# EAGLE board LEDPanel (EAGLE 9.6.2), part 1 of 2
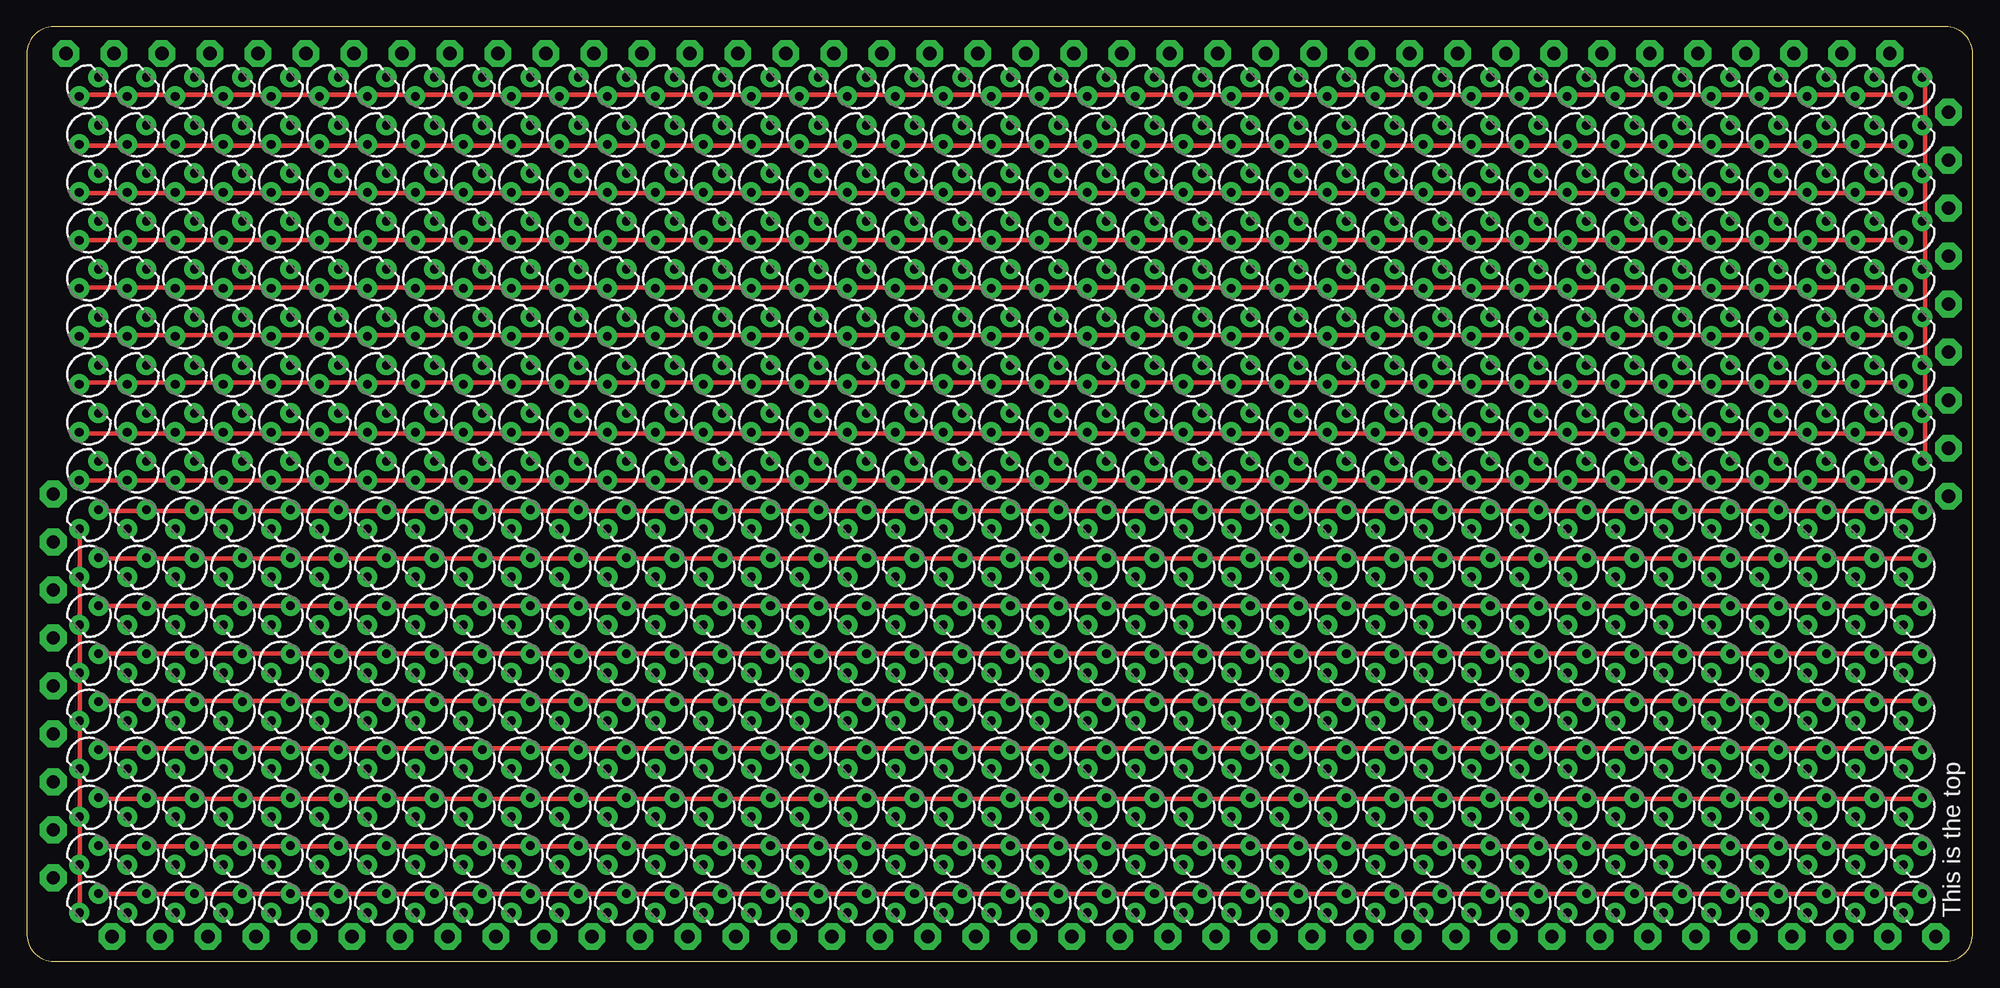
[diagram p1: board, top side]
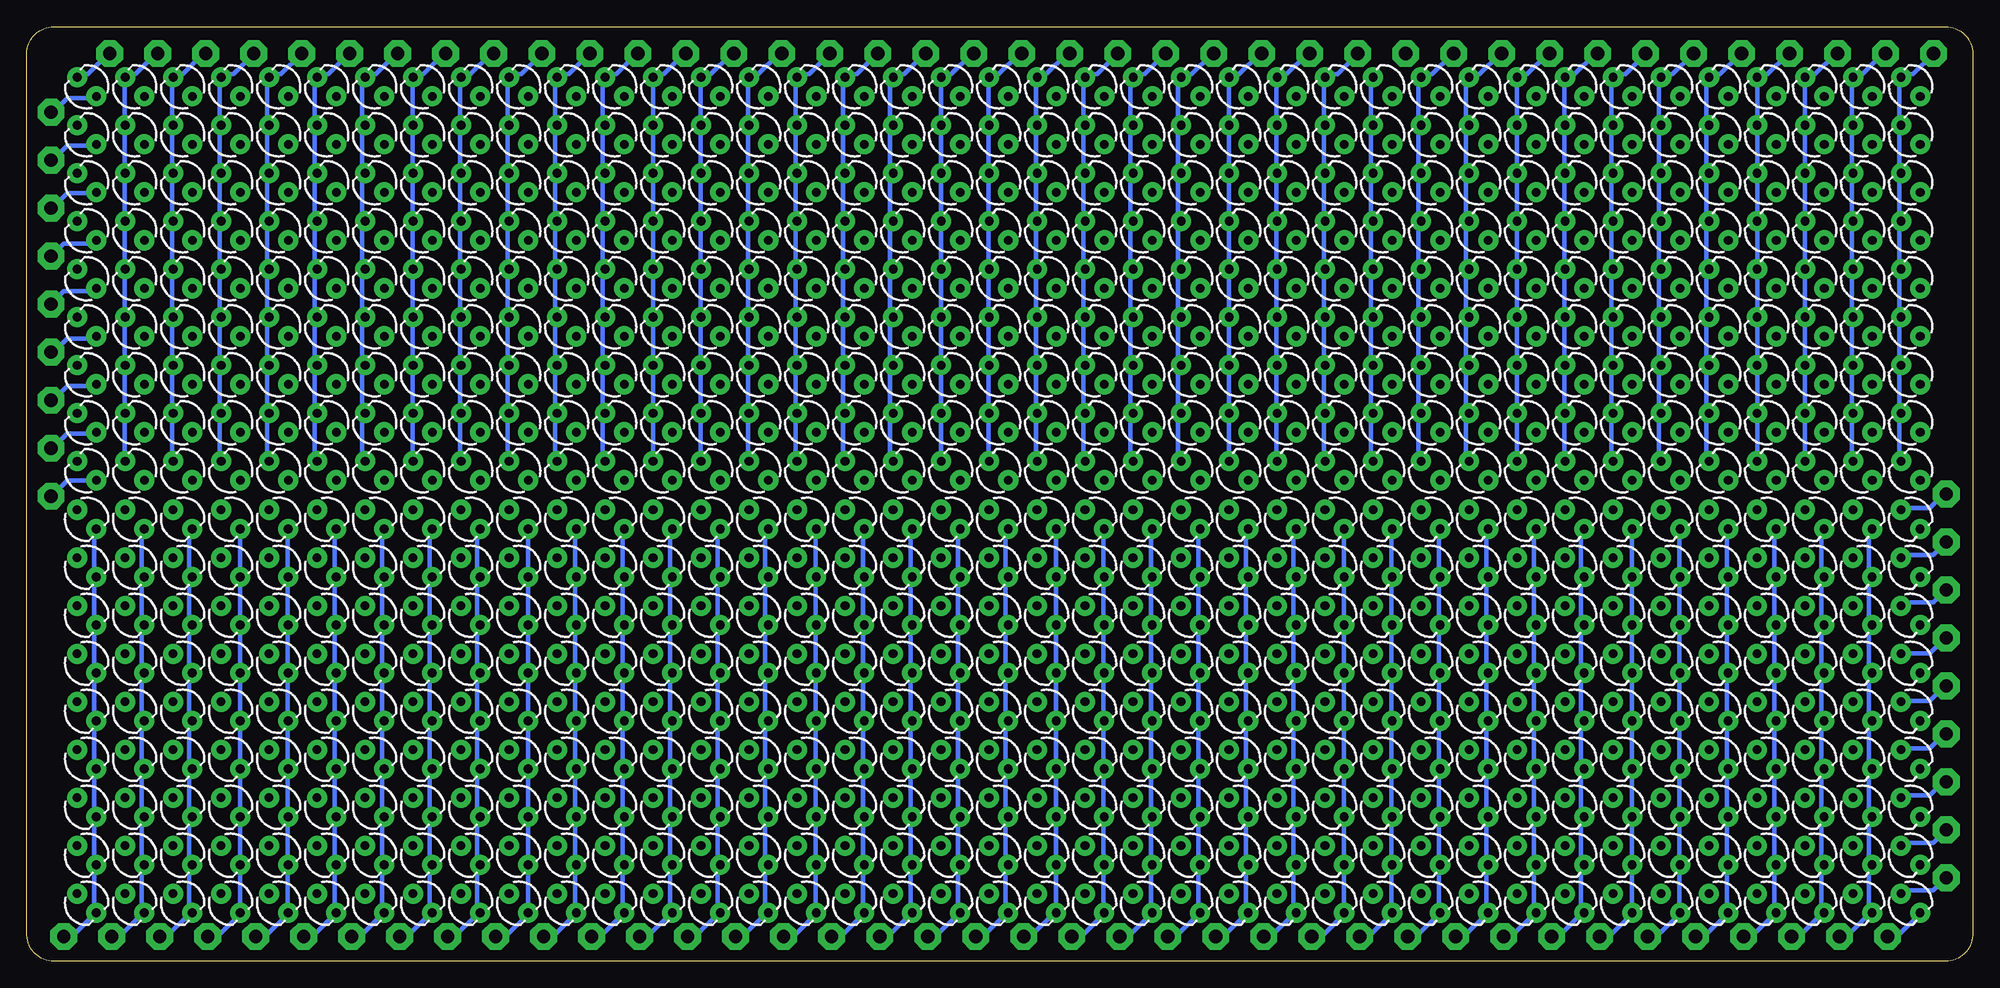
[diagram p2: board, bottom side, seen from below]

Size 182.46 x 87.65 mm. Coordinates in mm from the lower left corner, seen from the top.
Outline: 0,85.11 0,2.67 arc90 2.54,0 179.92,0 arc90 182.46,2.67 182.46,85.11 arc90 179.92,87.65 2.54,87.65 arc90 0,85.11
Copper layers (1*16): Top 0.035mm / dielectric 1.5mm / Bottom 0.035mm
Design rules "default *": minimum track width 16mil, minimum drill 0.3mm, track to track 6mil, track to pad 6mil, pad to pad 6mil, via to via 6mil, smd to smd 6mil, copper to edge 40mil, drill to drill 6mil, minimum pad ring 10mil, minimum via ring 8mil, stop-mask expansion 4mil, vias tented up to drill 20mil, thermal gap 10mil

## Footprints (pad centres in the part's own frame; a part is rotated, then mirrored left to right if it is on the bottom)
LED_3MM = drill 0.813 pad 1.88: A -1.27,0; K 1.27,0
COLUMNS = drill 1.25 pad 2.5 octagon: P$1 0,0; P$2 4.5,0; P$3 9,0; P$4 13.5,0; P$5 18,0; P$6 22.5,0; P$7 27,0; P$8 31.5,0; P$9 36,0; P$10 40.5,0; P$11 45,0; P$12 49.5,0; P$13 54,0; P$14 58.5,0; P$15 63,0; P$16 67.5,0; P$17 72,0; P$18 76.5,0; P$19 81,0; P$20 85.5,0; P$21 90,0; P$22 94.5,0; P$23 99,0; P$24 103.5,0; P$25 108,0; P$26 112.5,0; P$27 117,0; P$28 121.5,0; P$29 126,0; P$30 130.5,0; P$31 135,0; P$32 139.5,0; P$33 144,0; P$34 148.5,0; P$35 153,0; P$36 157.5,0; P$37 162,0; P$38 166.5,0; P$39 171,0
ROWS = drill 1.25 pad 2.5 octagon: P$1 0,0; P$2 0,-4.5; P$3 0,-9; P$4 0,-13.5; P$5 0,-18; P$6 0,-22.5; P$7 0,-27; P$8 0,-31.5; P$9 0,-36

## Placement (x,y rotation side)
LED1  [LED_3MM]  5.83,46.01 45 top
LED2  [LED_3MM]  10.33,46.01 45 top
LED3  [LED_3MM]  14.83,46.01 45 top
LED4  [LED_3MM]  19.33,46.01 45 top
LED5  [LED_3MM]  23.83,46.01 45 top
LED6  [LED_3MM]  28.33,46.01 45 top
LED7  [LED_3MM]  32.83,46.01 45 top
LED8  [LED_3MM]  37.33,46.01 45 top
LED9  [LED_3MM]  41.83,46.01 45 top
LED10  [LED_3MM]  46.33,46.01 45 top
LED11  [LED_3MM]  50.83,46.01 45 top
LED12  [LED_3MM]  55.33,46.01 45 top
LED13  [LED_3MM]  59.83,46.01 45 top
LED14  [LED_3MM]  64.33,46.01 45 top
LED15  [LED_3MM]  68.83,46.01 45 top
LED16  [LED_3MM]  73.33,46.01 45 top
LED17  [LED_3MM]  77.83,46.01 45 top
LED18  [LED_3MM]  82.33,46.01 45 top
LED19  [LED_3MM]  86.83,46.01 45 top
LED20  [LED_3MM]  91.33,46.01 45 top
LED21  [LED_3MM]  95.83,46.01 45 top
LED22  [LED_3MM]  100.33,46.01 45 top
LED23  [LED_3MM]  104.83,46.01 45 top
LED24  [LED_3MM]  109.33,46.01 45 top
LED25  [LED_3MM]  113.83,46.01 45 top
LED26  [LED_3MM]  118.33,46.01 45 top
LED27  [LED_3MM]  122.83,46.01 45 top
LED28  [LED_3MM]  127.33,46.01 45 top
LED29  [LED_3MM]  131.83,46.01 45 top
LED30  [LED_3MM]  136.33,46.01 45 top
LED31  [LED_3MM]  140.83,46.01 45 top
LED32  [LED_3MM]  145.33,46.01 45 top
LED33  [LED_3MM]  149.83,46.01 45 top
LED34  [LED_3MM]  154.33,46.01 45 top
LED35  [LED_3MM]  158.83,46.01 45 top
LED36  [LED_3MM]  163.33,46.01 45 top
LED37  [LED_3MM]  167.83,46.01 45 top
LED38  [LED_3MM]  172.33,46.01 45 top
LED39  [LED_3MM]  176.83,46.01 45 top
LED313  [LED_3MM]  5.83,50.51 45 top
LED314  [LED_3MM]  5.83,55.01 45 top
LED315  [LED_3MM]  5.83,59.51 45 top
LED316  [LED_3MM]  5.83,64.01 45 top
LED317  [LED_3MM]  5.83,68.51 45 top
LED318  [LED_3MM]  5.83,73.01 45 top
LED319  [LED_3MM]  5.83,77.51 45 top
LED320  [LED_3MM]  5.83,82.01 45 top
LED321  [LED_3MM]  10.33,50.51 45 top
LED322  [LED_3MM]  10.33,55.01 45 top
LED323  [LED_3MM]  10.33,59.51 45 top
LED324  [LED_3MM]  10.33,64.01 45 top
LED325  [LED_3MM]  10.33,68.51 45 top
LED326  [LED_3MM]  10.33,73.01 45 top
LED327  [LED_3MM]  10.33,77.51 45 top
LED328  [LED_3MM]  10.33,82.01 45 top
LED329  [LED_3MM]  14.83,50.51 45 top
LED330  [LED_3MM]  14.83,55.01 45 top
LED331  [LED_3MM]  14.83,59.51 45 top
LED332  [LED_3MM]  14.83,64.01 45 top
LED333  [LED_3MM]  14.83,68.51 45 top
LED334  [LED_3MM]  14.83,73.01 45 top
LED335  [LED_3MM]  14.83,77.51 45 top
LED336  [LED_3MM]  14.83,82.01 45 top
LED337  [LED_3MM]  19.33,50.51 45 top
LED338  [LED_3MM]  19.33,55.01 45 top
LED339  [LED_3MM]  19.33,59.51 45 top
LED340  [LED_3MM]  19.33,64.01 45 top
LED341  [LED_3MM]  19.33,68.51 45 top
LED342  [LED_3MM]  19.33,73.01 45 top
LED343  [LED_3MM]  19.33,77.51 45 top
LED344  [LED_3MM]  19.33,82.01 45 top
LED345  [LED_3MM]  23.83,50.51 45 top
LED346  [LED_3MM]  23.83,55.01 45 top
LED347  [LED_3MM]  23.83,59.51 45 top
LED348  [LED_3MM]  23.83,64.01 45 top
LED349  [LED_3MM]  23.83,68.51 45 top
LED350  [LED_3MM]  23.83,73.01 45 top
LED351  [LED_3MM]  23.83,77.51 45 top
LED352  [LED_3MM]  23.83,82.01 45 top
LED353  [LED_3MM]  28.33,50.51 45 top
LED354  [LED_3MM]  28.33,55.01 45 top
LED355  [LED_3MM]  28.33,59.51 45 top
LED356  [LED_3MM]  28.33,64.01 45 top
LED357  [LED_3MM]  28.33,68.51 45 top
LED358  [LED_3MM]  28.33,73.01 45 top
LED359  [LED_3MM]  28.33,77.51 45 top
LED360  [LED_3MM]  28.33,82.01 45 top
LED361  [LED_3MM]  32.83,50.51 45 top
LED362  [LED_3MM]  32.83,55.01 45 top
LED363  [LED_3MM]  32.83,59.51 45 top
LED364  [LED_3MM]  32.83,64.01 45 top
LED365  [LED_3MM]  32.83,68.51 45 top
LED366  [LED_3MM]  32.83,73.01 45 top
LED367  [LED_3MM]  32.83,77.51 45 top
LED368  [LED_3MM]  32.83,82.01 45 top
LED369  [LED_3MM]  37.33,50.51 45 top
LED370  [LED_3MM]  37.33,55.01 45 top
LED371  [LED_3MM]  37.33,59.51 45 top
LED372  [LED_3MM]  37.33,64.01 45 top
LED373  [LED_3MM]  37.33,68.51 45 top
LED374  [LED_3MM]  37.33,73.01 45 top
LED375  [LED_3MM]  37.33,77.51 45 top
LED376  [LED_3MM]  37.33,82.01 45 top
LED377  [LED_3MM]  41.83,50.51 45 top
LED378  [LED_3MM]  41.83,55.01 45 top
LED379  [LED_3MM]  41.83,59.51 45 top
LED380  [LED_3MM]  41.83,64.01 45 top
LED381  [LED_3MM]  41.83,68.51 45 top
LED382  [LED_3MM]  41.83,73.01 45 top
LED383  [LED_3MM]  41.83,77.51 45 top
LED384  [LED_3MM]  41.83,82.01 45 top
LED385  [LED_3MM]  46.33,50.51 45 top
LED386  [LED_3MM]  46.33,55.01 45 top
LED387  [LED_3MM]  46.33,59.51 45 top
LED388  [LED_3MM]  46.33,64.01 45 top
LED389  [LED_3MM]  46.33,68.51 45 top
LED390  [LED_3MM]  46.33,73.01 45 top
LED391  [LED_3MM]  46.33,77.51 45 top
LED392  [LED_3MM]  46.33,82.01 45 top
LED393  [LED_3MM]  50.83,50.51 45 top
LED394  [LED_3MM]  50.83,55.01 45 top
LED395  [LED_3MM]  50.83,59.51 45 top
LED396  [LED_3MM]  50.83,64.01 45 top
LED397  [LED_3MM]  50.83,68.51 45 top
LED398  [LED_3MM]  50.83,73.01 45 top
LED399  [LED_3MM]  50.83,77.51 45 top
LED400  [LED_3MM]  50.83,82.01 45 top
LED401  [LED_3MM]  55.33,50.51 45 top
LED402  [LED_3MM]  55.33,55.01 45 top
LED403  [LED_3MM]  55.33,59.51 45 top
LED404  [LED_3MM]  55.33,64.01 45 top
LED405  [LED_3MM]  55.33,68.51 45 top
LED406  [LED_3MM]  55.33,73.01 45 top
LED407  [LED_3MM]  55.33,77.51 45 top
LED408  [LED_3MM]  55.33,82.01 45 top
LED409  [LED_3MM]  59.83,50.51 45 top
LED410  [LED_3MM]  59.83,55.01 45 top
LED411  [LED_3MM]  59.83,59.51 45 top
LED412  [LED_3MM]  59.83,64.01 45 top
LED413  [LED_3MM]  59.83,68.51 45 top
LED414  [LED_3MM]  59.83,73.01 45 top
LED415  [LED_3MM]  59.83,77.51 45 top
LED416  [LED_3MM]  59.83,82.01 45 top
LED417  [LED_3MM]  64.33,50.51 45 top
LED418  [LED_3MM]  64.33,55.01 45 top
LED419  [LED_3MM]  64.33,59.51 45 top
LED420  [LED_3MM]  64.33,64.01 45 top
LED421  [LED_3MM]  64.33,68.51 45 top
LED422  [LED_3MM]  64.33,73.01 45 top
LED423  [LED_3MM]  64.33,77.51 45 top
LED424  [LED_3MM]  64.33,82.01 45 top
LED425  [LED_3MM]  68.83,50.51 45 top
LED426  [LED_3MM]  68.83,55.01 45 top
LED427  [LED_3MM]  68.83,59.51 45 top
LED428  [LED_3MM]  68.83,64.01 45 top
LED429  [LED_3MM]  68.83,68.51 45 top
LED430  [LED_3MM]  68.83,73.01 45 top
LED431  [LED_3MM]  68.83,77.51 45 top
LED432  [LED_3MM]  68.83,82.01 45 top
LED433  [LED_3MM]  73.33,50.51 45 top
LED434  [LED_3MM]  73.33,55.01 45 top
LED435  [LED_3MM]  73.33,59.51 45 top
LED436  [LED_3MM]  73.33,64.01 45 top
LED437  [LED_3MM]  73.33,68.51 45 top
LED438  [LED_3MM]  73.33,73.01 45 top
LED439  [LED_3MM]  73.33,77.51 45 top
LED440  [LED_3MM]  73.33,82.01 45 top
LED441  [LED_3MM]  77.83,50.51 45 top
LED442  [LED_3MM]  77.83,55.01 45 top
LED443  [LED_3MM]  77.83,59.51 45 top
LED444  [LED_3MM]  77.83,64.01 45 top
LED445  [LED_3MM]  77.83,68.51 45 top
LED446  [LED_3MM]  77.83,73.01 45 top
LED447  [LED_3MM]  77.83,77.51 45 top
LED448  [LED_3MM]  77.83,82.01 45 top
LED449  [LED_3MM]  82.33,50.51 45 top
LED450  [LED_3MM]  82.33,55.01 45 top
LED451  [LED_3MM]  82.33,59.51 45 top
LED452  [LED_3MM]  82.33,64.01 45 top
LED453  [LED_3MM]  82.33,68.51 45 top
LED454  [LED_3MM]  82.33,73.01 45 top
LED455  [LED_3MM]  82.33,77.51 45 top
LED456  [LED_3MM]  82.33,82.01 45 top
LED457  [LED_3MM]  86.83,50.51 45 top
LED458  [LED_3MM]  86.83,55.01 45 top
LED459  [LED_3MM]  86.83,59.51 45 top
LED460  [LED_3MM]  86.83,64.01 45 top
LED461  [LED_3MM]  86.83,68.51 45 top
LED462  [LED_3MM]  86.83,73.01 45 top
LED463  [LED_3MM]  86.83,77.51 45 top
LED464  [LED_3MM]  86.83,82.01 45 top
LED465  [LED_3MM]  91.33,50.51 45 top
LED466  [LED_3MM]  91.33,55.01 45 top
LED467  [LED_3MM]  91.33,59.51 45 top
LED468  [LED_3MM]  91.33,64.01 45 top
LED469  [LED_3MM]  91.33,68.51 45 top
LED470  [LED_3MM]  91.33,73.01 45 top
LED471  [LED_3MM]  91.33,77.51 45 top
LED472  [LED_3MM]  91.33,82.01 45 top
LED473  [LED_3MM]  95.83,50.51 45 top
LED474  [LED_3MM]  95.83,55.01 45 top
LED475  [LED_3MM]  95.83,59.51 45 top
LED476  [LED_3MM]  95.83,64.01 45 top
LED477  [LED_3MM]  95.83,68.51 45 top
LED478  [LED_3MM]  95.83,73.01 45 top
LED479  [LED_3MM]  95.83,77.51 45 top
LED480  [LED_3MM]  95.83,82.01 45 top
LED481  [LED_3MM]  100.33,50.51 45 top
LED482  [LED_3MM]  100.33,55.01 45 top
LED483  [LED_3MM]  100.33,59.51 45 top
LED484  [LED_3MM]  100.33,64.01 45 top
LED485  [LED_3MM]  100.33,68.51 45 top
LED486  [LED_3MM]  100.33,73.01 45 top
LED487  [LED_3MM]  100.33,77.51 45 top
LED488  [LED_3MM]  100.33,82.01 45 top
LED489  [LED_3MM]  104.83,50.51 45 top
LED490  [LED_3MM]  104.83,55.01 45 top
LED491  [LED_3MM]  104.83,59.51 45 top
LED492  [LED_3MM]  104.83,64.01 45 top
LED493  [LED_3MM]  104.83,68.51 45 top
LED494  [LED_3MM]  104.83,73.01 45 top
LED495  [LED_3MM]  104.83,77.51 45 top
LED496  [LED_3MM]  104.83,82.01 45 top
LED497  [LED_3MM]  109.33,50.51 45 top
LED498  [LED_3MM]  109.33,55.01 45 top
LED499  [LED_3MM]  109.33,59.51 45 top
LED500  [LED_3MM]  109.33,64.01 45 top
LED501  [LED_3MM]  109.33,68.51 45 top
LED502  [LED_3MM]  109.33,73.01 45 top
LED503  [LED_3MM]  109.33,77.51 45 top
LED504  [LED_3MM]  109.33,82.01 45 top
LED505  [LED_3MM]  113.83,50.51 45 top
LED506  [LED_3MM]  113.83,55.01 45 top
LED507  [LED_3MM]  113.83,59.51 45 top
LED508  [LED_3MM]  113.83,64.01 45 top
LED509  [LED_3MM]  113.83,68.51 45 top
LED510  [LED_3MM]  113.83,73.01 45 top
LED511  [LED_3MM]  113.83,77.51 45 top
LED512  [LED_3MM]  113.83,82.01 45 top
LED513  [LED_3MM]  118.33,50.51 45 top
LED514  [LED_3MM]  118.33,55.01 45 top
LED515  [LED_3MM]  118.33,59.51 45 top
LED516  [LED_3MM]  118.33,64.01 45 top
LED517  [LED_3MM]  118.33,68.51 45 top
LED518  [LED_3MM]  118.33,73.01 45 top
LED519  [LED_3MM]  118.33,77.51 45 top
LED520  [LED_3MM]  118.33,82.01 45 top
LED521  [LED_3MM]  122.83,50.51 45 top
LED522  [LED_3MM]  122.83,55.01 45 top
LED523  [LED_3MM]  122.83,59.51 45 top
LED524  [LED_3MM]  122.83,64.01 45 top
LED525  [LED_3MM]  122.83,68.51 45 top
LED526  [LED_3MM]  122.83,73.01 45 top
LED527  [LED_3MM]  122.83,77.51 45 top
LED528  [LED_3MM]  122.83,82.01 45 top
LED529  [LED_3MM]  127.33,50.51 45 top
LED530  [LED_3MM]  127.33,55.01 45 top
LED531  [LED_3MM]  127.33,59.51 45 top
LED532  [LED_3MM]  127.33,64.01 45 top
LED533  [LED_3MM]  127.33,68.51 45 top
LED534  [LED_3MM]  127.33,73.01 45 top
LED535  [LED_3MM]  127.33,77.51 45 top
LED536  [LED_3MM]  127.33,82.01 45 top
LED537  [LED_3MM]  131.83,50.51 45 top
LED538  [LED_3MM]  131.83,55.01 45 top
LED539  [LED_3MM]  131.83,59.51 45 top
LED540  [LED_3MM]  131.83,64.01 45 top
LED541  [LED_3MM]  131.83,68.51 45 top
LED542  [LED_3MM]  131.83,73.01 45 top
LED543  [LED_3MM]  131.83,77.51 45 top
LED544  [LED_3MM]  131.83,82.01 45 top
LED545  [LED_3MM]  136.33,50.51 45 top
LED546  [LED_3MM]  136.33,55.01 45 top
LED547  [LED_3MM]  136.33,59.51 45 top
LED548  [LED_3MM]  136.33,64.01 45 top
LED549  [LED_3MM]  136.33,68.51 45 top
LED550  [LED_3MM]  136.33,73.01 45 top
LED551  [LED_3MM]  136.33,77.51 45 top
LED552  [LED_3MM]  136.33,82.01 45 top
LED553  [LED_3MM]  140.83,50.51 45 top
LED554  [LED_3MM]  140.83,55.01 45 top
LED555  [LED_3MM]  140.83,59.51 45 top
LED556  [LED_3MM]  140.83,64.01 45 top
LED557  [LED_3MM]  140.83,68.51 45 top
LED558  [LED_3MM]  140.83,73.01 45 top
LED559  [LED_3MM]  140.83,77.51 45 top
LED560  [LED_3MM]  140.83,82.01 45 top
LED561  [LED_3MM]  145.33,50.51 45 top
LED562  [LED_3MM]  145.33,55.01 45 top
LED563  [LED_3MM]  145.33,59.51 45 top
LED564  [LED_3MM]  145.33,64.01 45 top
LED565  [LED_3MM]  145.33,68.51 45 top
LED566  [LED_3MM]  145.33,73.01 45 top
LED567  [LED_3MM]  145.33,77.51 45 top
LED568  [LED_3MM]  145.33,82.01 45 top
LED569  [LED_3MM]  149.83,50.51 45 top
LED570  [LED_3MM]  149.83,55.01 45 top
LED571  [LED_3MM]  149.83,59.51 45 top
LED572  [LED_3MM]  149.83,64.01 45 top
LED573  [LED_3MM]  149.83,68.51 45 top
LED574  [LED_3MM]  149.83,73.01 45 top
LED575  [LED_3MM]  149.83,77.51 45 top
LED576  [LED_3MM]  149.83,82.01 45 top
LED577  [LED_3MM]  154.33,50.51 45 top
LED578  [LED_3MM]  154.33,55.01 45 top
LED579  [LED_3MM]  154.33,59.51 45 top
LED580  [LED_3MM]  154.33,64.01 45 top
LED581  [LED_3MM]  154.33,68.51 45 top
LED582  [LED_3MM]  154.33,73.01 45 top
LED583  [LED_3MM]  154.33,77.51 45 top
LED584  [LED_3MM]  154.33,82.01 45 top
LED585  [LED_3MM]  158.83,50.51 45 top
LED586  [LED_3MM]  158.83,55.01 45 top
LED587  [LED_3MM]  158.83,59.51 45 top
LED588  [LED_3MM]  158.83,64.01 45 top
LED589  [LED_3MM]  158.83,68.51 45 top
LED590  [LED_3MM]  158.83,73.01 45 top
LED591  [LED_3MM]  158.83,77.51 45 top
LED592  [LED_3MM]  158.83,82.01 45 top
LED593  [LED_3MM]  163.33,50.51 45 top
LED594  [LED_3MM]  163.33,55.01 45 top
LED595  [LED_3MM]  163.33,59.51 45 top
LED596  [LED_3MM]  163.33,64.01 45 top
LED597  [LED_3MM]  163.33,68.51 45 top
LED598  [LED_3MM]  163.33,73.01 45 top
LED599  [LED_3MM]  163.33,77.51 45 top
LED600  [LED_3MM]  163.33,82.01 45 top
LED601  [LED_3MM]  167.83,50.51 45 top
LED602  [LED_3MM]  167.83,55.01 45 top
LED603  [LED_3MM]  167.83,59.51 45 top
LED604  [LED_3MM]  167.83,64.01 45 top
LED605  [LED_3MM]  167.83,68.51 45 top
LED606  [LED_3MM]  167.83,73.01 45 top
LED607  [LED_3MM]  167.83,77.51 45 top
LED608  [LED_3MM]  167.83,82.01 45 top
LED609  [LED_3MM]  172.33,50.51 45 top
LED610  [LED_3MM]  172.33,55.01 45 top
LED611  [LED_3MM]  172.33,59.51 45 top
LED612  [LED_3MM]  172.33,64.01 45 top
LED613  [LED_3MM]  172.33,68.51 45 top
LED614  [LED_3MM]  172.33,73.01 45 top
LED615  [LED_3MM]  172.33,77.51 45 top
LED616  [LED_3MM]  172.33,82.01 45 top
LED617  [LED_3MM]  176.83,50.51 45 top
LED618  [LED_3MM]  176.83,55.01 45 top
LED619  [LED_3MM]  176.83,59.51 45 top
LED620  [LED_3MM]  176.83,64.01 45 top
LED621  [LED_3MM]  176.83,68.51 45 top
LED622  [LED_3MM]  176.83,73.01 45 top
LED623  [LED_3MM]  176.83,77.51 45 top
LED624  [LED_3MM]  176.83,82.01 45 top
LED703  [LED_3MM]  176.84,36.95 225 top
LED704  [LED_3MM]  176.84,32.45 225 top
LED705  [LED_3MM]  176.84,27.95 225 top
LED706  [LED_3MM]  176.84,23.45 225 top
LED707  [LED_3MM]  176.84,18.95 225 top
LED708  [LED_3MM]  176.84,14.45 225 top
LED709  [LED_3MM]  176.84,9.95 225 top
LED710  [LED_3MM]  176.84,5.45 225 top
LED711  [LED_3MM]  172.34,36.95 225 top
LED712  [LED_3MM]  172.34,32.45 225 top
LED713  [LED_3MM]  172.34,27.95 225 top
LED714  [LED_3MM]  172.34,23.45 225 top
LED715  [LED_3MM]  172.34,18.95 225 top
LED716  [LED_3MM]  172.34,14.45 225 top
LED717  [LED_3MM]  172.34,9.95 225 top
LED718  [LED_3MM]  172.34,5.45 225 top
LED719  [LED_3MM]  167.84,36.95 225 top
LED720  [LED_3MM]  167.84,32.45 225 top
LED721  [LED_3MM]  167.84,27.95 225 top
LED722  [LED_3MM]  167.84,23.45 225 top
LED723  [LED_3MM]  167.84,18.95 225 top
LED724  [LED_3MM]  167.84,14.45 225 top
LED725  [LED_3MM]  167.84,9.95 225 top
LED726  [LED_3MM]  167.84,5.45 225 top
LED727  [LED_3MM]  163.34,36.95 225 top
LED728  [LED_3MM]  163.34,32.45 225 top
LED729  [LED_3MM]  163.34,27.95 225 top
LED730  [LED_3MM]  163.34,23.45 225 top
LED731  [LED_3MM]  163.34,18.95 225 top
LED732  [LED_3MM]  163.34,14.45 225 top
LED733  [LED_3MM]  163.34,9.95 225 top
LED734  [LED_3MM]  163.34,5.45 225 top
LED735  [LED_3MM]  158.84,36.95 225 top
LED736  [LED_3MM]  158.84,32.45 225 top
LED737  [LED_3MM]  158.84,27.95 225 top
LED738  [LED_3MM]  158.84,23.45 225 top
LED739  [LED_3MM]  158.84,18.95 225 top
LED740  [LED_3MM]  158.84,14.45 225 top
LED741  [LED_3MM]  158.84,9.95 225 top
LED742  [LED_3MM]  158.84,5.45 225 top
LED743  [LED_3MM]  154.34,36.95 225 top
LED744  [LED_3MM]  154.34,32.45 225 top
LED745  [LED_3MM]  154.34,27.95 225 top
LED746  [LED_3MM]  154.34,23.45 225 top
LED747  [LED_3MM]  154.34,18.95 225 top
LED748  [LED_3MM]  154.34,14.45 225 top
LED749  [LED_3MM]  154.34,9.95 225 top
LED750  [LED_3MM]  154.34,5.45 225 top
LED751  [LED_3MM]  149.84,36.95 225 top
LED752  [LED_3MM]  149.84,32.45 225 top
LED753  [LED_3MM]  149.84,27.95 225 top
LED754  [LED_3MM]  149.84,23.45 225 top
LED755  [LED_3MM]  149.84,18.95 225 top
LED756  [LED_3MM]  149.84,14.45 225 top
LED757  [LED_3MM]  149.84,9.95 225 top
LED758  [LED_3MM]  149.84,5.45 225 top
LED759  [LED_3MM]  145.34,36.95 225 top
LED760  [LED_3MM]  145.34,32.45 225 top
LED761  [LED_3MM]  145.34,27.95 225 top
LED762  [LED_3MM]  145.34,23.45 225 top
LED763  [LED_3MM]  145.34,18.95 225 top
LED764  [LED_3MM]  145.34,14.45 225 top
LED765  [LED_3MM]  145.34,9.95 225 top
LED766  [LED_3MM]  145.34,5.45 225 top
LED767  [LED_3MM]  140.84,36.95 225 top
LED768  [LED_3MM]  140.84,32.45 225 top
LED769  [LED_3MM]  140.84,27.95 225 top
LED770  [LED_3MM]  140.84,23.45 225 top
LED771  [LED_3MM]  140.84,18.95 225 top
LED772  [LED_3MM]  140.84,14.45 225 top
LED773  [LED_3MM]  140.84,9.95 225 top
LED774  [LED_3MM]  140.84,5.45 225 top
LED775  [LED_3MM]  136.34,36.95 225 top
LED776  [LED_3MM]  136.34,32.45 225 top
LED777  [LED_3MM]  136.34,27.95 225 top
LED778  [LED_3MM]  136.34,23.45 225 top
LED779  [LED_3MM]  136.34,18.95 225 top
LED780  [LED_3MM]  136.34,14.45 225 top
LED781  [LED_3MM]  136.34,9.95 225 top
LED782  [LED_3MM]  136.34,5.45 225 top
LED783  [LED_3MM]  131.84,36.95 225 top
LED784  [LED_3MM]  131.84,32.45 225 top
LED785  [LED_3MM]  131.84,27.95 225 top
LED786  [LED_3MM]  131.84,23.45 225 top
LED787  [LED_3MM]  131.84,18.95 225 top
LED788  [LED_3MM]  131.84,14.45 225 top
LED789  [LED_3MM]  131.84,9.95 225 top
LED790  [LED_3MM]  131.84,5.45 225 top
LED791  [LED_3MM]  127.34,36.95 225 top
LED792  [LED_3MM]  127.34,32.45 225 top
LED793  [LED_3MM]  127.34,27.95 225 top
LED794  [LED_3MM]  127.34,23.45 225 top
LED795  [LED_3MM]  127.34,18.95 225 top
LED796  [LED_3MM]  127.34,14.45 225 top
LED797  [LED_3MM]  127.34,9.95 225 top
LED798  [LED_3MM]  127.34,5.45 225 top
LED799  [LED_3MM]  122.84,36.95 225 top
LED800  [LED_3MM]  122.84,32.45 225 top
LED801  [LED_3MM]  122.84,27.95 225 top
LED802  [LED_3MM]  122.84,23.45 225 top
LED803  [LED_3MM]  122.84,18.95 225 top
LED804  [LED_3MM]  122.84,14.45 225 top
LED805  [LED_3MM]  122.84,9.95 225 top
LED806  [LED_3MM]  122.84,5.45 225 top
LED807  [LED_3MM]  118.34,36.95 225 top
LED808  [LED_3MM]  118.34,32.45 225 top
LED809  [LED_3MM]  118.34,27.95 225 top
LED810  [LED_3MM]  118.34,23.45 225 top
LED811  [LED_3MM]  118.34,18.95 225 top
LED812  [LED_3MM]  118.34,14.45 225 top
LED813  [LED_3MM]  118.34,9.95 225 top
LED814  [LED_3MM]  118.34,5.45 225 top
LED815  [LED_3MM]  113.84,36.95 225 top
LED816  [LED_3MM]  113.84,32.45 225 top
LED817  [LED_3MM]  113.84,27.95 225 top
LED818  [LED_3MM]  113.84,23.45 225 top
LED819  [LED_3MM]  113.84,18.95 225 top
LED820  [LED_3MM]  113.84,14.45 225 top
LED821  [LED_3MM]  113.84,9.95 225 top
LED822  [LED_3MM]  113.84,5.45 225 top
LED823  [LED_3MM]  109.34,36.95 225 top
LED824  [LED_3MM]  109.34,32.45 225 top
LED825  [LED_3MM]  109.34,27.95 225 top
LED826  [LED_3MM]  109.34,23.45 225 top
LED827  [LED_3MM]  109.34,18.95 225 top
LED828  [LED_3MM]  109.34,14.45 225 top
LED829  [LED_3MM]  109.34,9.95 225 top
LED830  [LED_3MM]  109.34,5.45 225 top
LED831  [LED_3MM]  104.84,36.95 225 top
LED832  [LED_3MM]  104.84,32.45 225 top
LED833  [LED_3MM]  104.84,27.95 225 top
LED834  [LED_3MM]  104.84,23.45 225 top
LED835  [LED_3MM]  104.84,18.95 225 top
LED836  [LED_3MM]  104.84,14.45 225 top
LED837  [LED_3MM]  104.84,9.95 225 top
LED838  [LED_3MM]  104.84,5.45 225 top
LED839  [LED_3MM]  100.34,36.95 225 top
LED840  [LED_3MM]  100.34,32.45 225 top
LED841  [LED_3MM]  100.34,27.95 225 top
LED842  [LED_3MM]  100.34,23.45 225 top
LED843  [LED_3MM]  100.34,18.95 225 top
LED844  [LED_3MM]  100.34,14.45 225 top
LED845  [LED_3MM]  100.34,9.95 225 top
LED846  [LED_3MM]  100.34,5.45 225 top
LED847  [LED_3MM]  95.84,36.95 225 top
LED848  [LED_3MM]  95.84,32.45 225 top
LED849  [LED_3MM]  95.84,27.95 225 top
LED850  [LED_3MM]  95.84,23.45 225 top
LED851  [LED_3MM]  95.84,18.95 225 top
LED852  [LED_3MM]  95.84,14.45 225 top
LED853  [LED_3MM]  95.84,9.95 225 top
LED854  [LED_3MM]  95.84,5.45 225 top
LED855  [LED_3MM]  91.34,36.95 225 top
LED856  [LED_3MM]  91.34,32.45 225 top
LED857  [LED_3MM]  91.34,27.95 225 top
LED858  [LED_3MM]  91.34,23.45 225 top
LED859  [LED_3MM]  91.34,18.95 225 top
LED860  [LED_3MM]  91.34,14.45 225 top
LED861  [LED_3MM]  91.34,9.95 225 top
LED862  [LED_3MM]  91.34,5.45 225 top
LED863  [LED_3MM]  86.84,36.95 225 top
LED864  [LED_3MM]  86.84,32.45 225 top
LED865  [LED_3MM]  86.84,27.95 225 top
LED866  [LED_3MM]  86.84,23.45 225 top
LED867  [LED_3MM]  86.84,18.95 225 top
LED868  [LED_3MM]  86.84,14.45 225 top
LED869  [LED_3MM]  86.84,9.95 225 top
LED870  [LED_3MM]  86.84,5.45 225 top
LED871  [LED_3MM]  82.34,36.95 225 top
LED872  [LED_3MM]  82.34,32.45 225 top
LED873  [LED_3MM]  82.34,27.95 225 top
LED874  [LED_3MM]  82.34,23.45 225 top
LED875  [LED_3MM]  82.34,18.95 225 top
LED876  [LED_3MM]  82.34,14.45 225 top
LED877  [LED_3MM]  82.34,9.95 225 top
LED878  [LED_3MM]  82.34,5.45 225 top
LED879  [LED_3MM]  77.84,36.95 225 top
LED880  [LED_3MM]  77.84,32.45 225 top
LED881  [LED_3MM]  77.84,27.95 225 top
LED882  [LED_3MM]  77.84,23.45 225 top
LED883  [LED_3MM]  77.84,18.95 225 top
LED884  [LED_3MM]  77.84,14.45 225 top
LED885  [LED_3MM]  77.84,9.95 225 top
LED886  [LED_3MM]  77.84,5.45 225 top
LED887  [LED_3MM]  73.34,36.95 225 top
LED888  [LED_3MM]  73.34,32.45 225 top
LED889  [LED_3MM]  73.34,27.95 225 top
LED890  [LED_3MM]  73.34,23.45 225 top
LED891  [LED_3MM]  73.34,18.95 225 top
LED892  [LED_3MM]  73.34,14.45 225 top
LED893  [LED_3MM]  73.34,9.95 225 top
LED894  [LED_3MM]  73.34,5.45 225 top
LED895  [LED_3MM]  68.84,36.95 225 top
LED896  [LED_3MM]  68.84,32.45 225 top
LED897  [LED_3MM]  68.84,27.95 225 top
LED898  [LED_3MM]  68.84,23.45 225 top
LED899  [LED_3MM]  68.84,18.95 225 top
LED900  [LED_3MM]  68.84,14.45 225 top
LED901  [LED_3MM]  68.84,9.95 225 top
LED902  [LED_3MM]  68.84,5.45 225 top
LED903  [LED_3MM]  64.34,36.95 225 top
LED904  [LED_3MM]  64.34,32.45 225 top
LED905  [LED_3MM]  64.34,27.95 225 top
LED906  [LED_3MM]  64.34,23.45 225 top
LED907  [LED_3MM]  64.34,18.95 225 top
LED908  [LED_3MM]  64.34,14.45 225 top
LED909  [LED_3MM]  64.34,9.95 225 top
LED910  [LED_3MM]  64.34,5.45 225 top
LED911  [LED_3MM]  59.84,36.95 225 top
LED912  [LED_3MM]  59.84,32.45 225 top
LED913  [LED_3MM]  59.84,27.95 225 top
LED914  [LED_3MM]  59.84,23.45 225 top
LED915  [LED_3MM]  59.84,18.95 225 top
LED916  [LED_3MM]  59.84,14.45 225 top
LED917  [LED_3MM]  59.84,9.95 225 top
LED918  [LED_3MM]  59.84,5.45 225 top
LED919  [LED_3MM]  55.34,36.95 225 top
LED920  [LED_3MM]  55.34,32.45 225 top
LED921  [LED_3MM]  55.34,27.95 225 top
LED922  [LED_3MM]  55.34,23.45 225 top
LED923  [LED_3MM]  55.34,18.95 225 top
LED924  [LED_3MM]  55.34,14.45 225 top
LED925  [LED_3MM]  55.34,9.95 225 top
LED926  [LED_3MM]  55.34,5.45 225 top
LED927  [LED_3MM]  50.84,36.95 225 top
LED928  [LED_3MM]  50.84,32.45 225 top
LED929  [LED_3MM]  50.84,27.95 225 top
LED930  [LED_3MM]  50.84,23.45 225 top
LED931  [LED_3MM]  50.84,18.95 225 top
LED932  [LED_3MM]  50.84,14.45 225 top
LED933  [LED_3MM]  50.84,9.95 225 top
LED934  [LED_3MM]  50.84,5.45 225 top
LED935  [LED_3MM]  46.34,36.95 225 top
LED936  [LED_3MM]  46.34,32.45 225 top
LED937  [LED_3MM]  46.34,27.95 225 top
LED938  [LED_3MM]  46.34,23.45 225 top
LED939  [LED_3MM]  46.34,18.95 225 top
LED940  [LED_3MM]  46.34,14.45 225 top
LED941  [LED_3MM]  46.34,9.95 225 top
LED942  [LED_3MM]  46.34,5.45 225 top
LED943  [LED_3MM]  41.84,36.95 225 top
LED944  [LED_3MM]  41.84,32.45 225 top
LED945  [LED_3MM]  41.84,27.95 225 top
LED946  [LED_3MM]  41.84,23.45 225 top
LED947  [LED_3MM]  41.84,18.95 225 top
LED948  [LED_3MM]  41.84,14.45 225 top
LED949  [LED_3MM]  41.84,9.95 225 top
LED950  [LED_3MM]  41.84,5.45 225 top
LED951  [LED_3MM]  37.34,36.95 225 top
LED952  [LED_3MM]  37.34,32.45 225 top
LED953  [LED_3MM]  37.34,27.95 225 top
LED954  [LED_3MM]  37.34,23.45 225 top
LED955  [LED_3MM]  37.34,18.95 225 top
LED956  [LED_3MM]  37.34,14.45 225 top
LED957  [LED_3MM]  37.34,9.95 225 top
LED958  [LED_3MM]  37.34,5.45 225 top
LED959  [LED_3MM]  32.84,36.95 225 top
LED960  [LED_3MM]  32.84,32.45 225 top
LED961  [LED_3MM]  32.84,27.95 225 top
LED962  [LED_3MM]  32.84,23.45 225 top
LED963  [LED_3MM]  32.84,18.95 225 top
LED964  [LED_3MM]  32.84,14.45 225 top
LED965  [LED_3MM]  32.84,9.95 225 top
LED966  [LED_3MM]  32.84,5.45 225 top
LED967  [LED_3MM]  28.34,36.95 225 top
LED968  [LED_3MM]  28.34,32.45 225 top
LED969  [LED_3MM]  28.34,27.95 225 top
LED970  [LED_3MM]  28.34,23.45 225 top
LED971  [LED_3MM]  28.34,18.95 225 top
LED972  [LED_3MM]  28.34,14.45 225 top
LED973  [LED_3MM]  28.34,9.95 225 top
LED974  [LED_3MM]  28.34,5.45 225 top
LED975  [LED_3MM]  23.84,36.95 225 top
LED976  [LED_3MM]  23.84,32.45 225 top
LED977  [LED_3MM]  23.84,27.95 225 top
LED978  [LED_3MM]  23.84,23.45 225 top
LED979  [LED_3MM]  23.84,18.95 225 top
LED980  [LED_3MM]  23.84,14.45 225 top
LED981  [LED_3MM]  23.84,9.95 225 top
LED982  [LED_3MM]  23.84,5.45 225 top
LED983  [LED_3MM]  19.34,36.95 225 top
LED984  [LED_3MM]  19.34,32.45 225 top
LED985  [LED_3MM]  19.34,27.95 225 top
LED986  [LED_3MM]  19.34,23.45 225 top
LED987  [LED_3MM]  19.34,18.95 225 top
LED988  [LED_3MM]  19.34,14.45 225 top
LED989  [LED_3MM]  19.34,9.95 225 top
LED990  [LED_3MM]  19.34,5.45 225 top
LED991  [LED_3MM]  14.84,36.95 225 top
LED992  [LED_3MM]  14.84,32.45 225 top
LED993  [LED_3MM]  14.84,27.95 225 top
LED994  [LED_3MM]  14.84,23.45 225 top
LED995  [LED_3MM]  14.84,18.95 225 top
LED996  [LED_3MM]  14.84,14.45 225 top
LED997  [LED_3MM]  14.84,9.95 225 top
LED998  [LED_3MM]  14.84,5.45 225 top
LED999  [LED_3MM]  10.34,36.95 225 top
LED1000  [LED_3MM]  10.34,32.45 225 top
LED1001  [LED_3MM]  10.34,27.95 225 top
LED1002  [LED_3MM]  10.34,23.45 225 top
LED1003  [LED_3MM]  10.34,18.95 225 top
LED1004  [LED_3MM]  10.34,14.45 225 top
LED1005  [LED_3MM]  10.34,9.95 225 top
LED1006  [LED_3MM]  10.34,5.45 225 top
LED1007  [LED_3MM]  5.84,36.95 225 top
LED1008  [LED_3MM]  5.84,32.45 225 top
LED1009  [LED_3MM]  5.84,27.95 225 top
LED1010  [LED_3MM]  5.84,23.45 225 top
LED1011  [LED_3MM]  5.84,18.95 225 top
LED1012  [LED_3MM]  5.84,14.45 225 top
LED1013  [LED_3MM]  5.84,9.95 225 top
LED1014  [LED_3MM]  5.84,5.45 225 top
LED1015  [LED_3MM]  176.84,41.45 225 top
LED1016  [LED_3MM]  172.34,41.45 225 top
LED1017  [LED_3MM]  167.84,41.45 225 top
LED1018  [LED_3MM]  163.34,41.45 225 top
LED1019  [LED_3MM]  158.84,41.45 225 top
LED1020  [LED_3MM]  154.34,41.45 225 top
LED1021  [LED_3MM]  149.84,41.45 225 top
LED1022  [LED_3MM]  145.34,41.45 225 top
LED1023  [LED_3MM]  140.84,41.45 225 top
LED1024  [LED_3MM]  136.34,41.45 225 top
LED1025  [LED_3MM]  131.84,41.45 225 top
LED1026  [LED_3MM]  127.34,41.45 225 top
LED1027  [LED_3MM]  122.84,41.45 225 top
LED1028  [LED_3MM]  118.34,41.45 225 top
LED1029  [LED_3MM]  113.84,41.45 225 top
LED1030  [LED_3MM]  109.34,41.45 225 top
LED1031  [LED_3MM]  104.84,41.45 225 top
LED1032  [LED_3MM]  100.34,41.45 225 top
LED1033  [LED_3MM]  95.84,41.45 225 top
LED1034  [LED_3MM]  91.34,41.45 225 top
LED1035  [LED_3MM]  86.84,41.45 225 top
LED1036  [LED_3MM]  82.34,41.45 225 top
LED1037  [LED_3MM]  77.84,41.45 225 top
LED1038  [LED_3MM]  73.34,41.45 225 top
LED1039  [LED_3MM]  68.84,41.45 225 top
LED1040  [LED_3MM]  64.34,41.45 225 top
LED1041  [LED_3MM]  59.84,41.45 225 top
LED1042  [LED_3MM]  55.34,41.45 225 top
LED1043  [LED_3MM]  50.84,41.45 225 top
LED1044  [LED_3MM]  46.34,41.45 225 top
LED1045  [LED_3MM]  41.84,41.45 225 top
LED1046  [LED_3MM]  37.34,41.45 225 top
LED1047  [LED_3MM]  32.84,41.45 225 top
LED1048  [LED_3MM]  28.34,41.45 225 top
LED1049  [LED_3MM]  23.84,41.45 225 top
LED1050  [LED_3MM]  19.34,41.45 225 top
LED1051  [LED_3MM]  14.84,41.45 225 top
LED1052  [LED_3MM]  10.34,41.45 225 top
LED1053  [LED_3MM]  5.84,41.45 225 top
U$1  39COLUMN  [COLUMNS]  174.68,85.13 180 top
U$2  39COLUMN  [COLUMNS]  7.99,2.33 0 top
U$3  9ROW  [ROWS]  2.49,7.83 180 top
U$4  9ROW  [ROWS]  180.18,79.63 0 top

## Tracks (layer width: path | path; a pad name or v marks a point on that pad's centre or on a via)
N$1
  Top 0.406: LED39.A 175.79,45.07 171.67,45.07 LED38.A 171.35,45.07 167.22,45.07 LED37.A 166.9,45.07 162.46,45.07 LED36.A 162.14,45.07 158.01,45.07 LED35.A 157.7,45.07 153.57,45.07 LED34.A 153.25,45.07 149.12,45.07 LED33.A 148.81,45.07 144.68,45.07 LED32.A 144.36,45.07 140.23,45.07 LED31.A 139.92,45.07 135.47,45.07 LED30.A 135.15,45.07 131.03,45.07 LED29.A 130.71,45.07 126.58,45.07 LED28.A 126.26,45.07 122.13,45.07 LED27.A 121.82,45.07 117.69,45.07 LED26.A 117.37,45.07 113.24,45.07 LED25.A 112.93,45.07 108.48,45.07 LED24.A 108.16,45.07 104.04,45.07 LED23.A 103.72,45.07 99.59,45.07 LED22.A 99.27,45.07 95.15,45.07 LED21.A 94.83,45.07 90.7,45.07 LED20.A 90.38,45.07 85.94,45.07 LED19.A 85.62,45.07 81.49,45.07 LED18.A 81.18,45.07 77.05,45.07 LED17.A 76.73,45.07 72.61,45.07 LED16.A 72.29,45.07 68.16,45.07 LED15.A 67.84,45.07 63.72,45.07 LED14.A 63.4,45.07 58.95,45.07 LED13.A 58.63,45.07 54.51,45.07 LED12.A 54.19,45.07 50.06,45.07 LED11.A 49.74,45.07 45.62,45.07 LED10.A 45.3,45.07 41.17,45.07 LED9.A 40.85,45.07 36.73,45.07 LED8.A 36.41,45.07 31.96,45.07 LED7.A 31.65,45.07 27.52,45.07 LED6.A 27.2,45.07 23.07,45.07 LED5.A 22.76,45.07 18.63,45.07 LED4.A 18.31,45.07 14.19,45.07 LED3.A 13.87,45.07 9.74,45.07 LED2.A 9.42,45.07 4.98,45.07 LED1.A
  Bottom 0.406: U$4.P$9 179.92,43.8 178.65,45.07 176.11,45.07 LED39.A
N$2
  Bottom 0.406: U$1.P$39 3.71,85.07 5.61,83.17 6.57,83.17 LED320.K 6.88,82.85 6.88,78.72 LED319.K 6.88,78.41 6.88,73.96 LED318.K 6.88,73.64 6.88,69.52 LED317.K 6.88,69.2 6.88,65.07 LED316.K 6.88,64.75 6.88,60.63 LED315.K 6.88,60.31 6.88,56.18 LED314.K 6.88,55.86 6.88,51.42 LED313.K 6.88,51.1 6.88,46.97 LED1.K
N$3
  Bottom 0.406: U$1.P$32 35.46,85.07 37.36,83.17 38,83.17 LED376.K 38.31,82.85 38.31,78.72 LED375.K 38.31,78.41 38.31,73.96 LED374.K 38.31,73.64 38.31,69.52 LED373.K 38.31,69.2 38.31,65.07 LED372.K 38.31,64.75 38.31,60.63 LED371.K 38.31,60.31 38.31,56.18 LED370.K 38.31,55.86 38.31,51.42 LED369.K 38.31,51.1 38.31,46.97 LED8.K
N$4
  Bottom 0.406: U$1.P$30 44.35,85.07 46.25,83.17 47.2,83.17 LED392.K 47.52,82.85 47.52,78.72 LED391.K 47.52,78.41 47.52,73.96 LED390.K 47.52,73.64 47.52,69.52 LED389.K 47.52,69.2 47.52,65.07 LED388.K 47.52,64.75 47.52,60.63 LED387.K 47.52,60.31 47.52,56.18 LED386.K 47.52,55.86 47.52,51.42 LED385.K 47.52,51.1 47.52,46.97 LED10.K
N$50
  Top 0.406: LED1053.K 4.98,40.31 4.98,36.18 LED1007.K 4.98,35.86 4.98,31.73 LED1008.K 4.98,31.42 4.98,27.29 LED1009.K 4.98,26.97 4.98,22.84 LED1010.K 4.98,22.53 4.98,18.08 LED1011.K 4.98,17.76 4.98,13.64 LED1012.K 4.98,13.32 4.98,9.19 LED1013.K 4.98,8.88 4.98,4.75 LED1014.K
  Bottom 0.406: LED1014.K 4.98,4.43 6.88,2.52 7.83,2.52 U$2.P$1
N$51
  Bottom 0.406: LED1052.K 9.74,40.31 9.74,36.18 LED999.K 9.74,35.86 9.74,31.73 LED1000.K 9.74,31.42 9.74,27.29 LED1001.K 9.74,26.97 9.74,22.84 LED1002.K 9.74,22.53 9.74,18.08 LED1003.K 9.74,17.76 9.74,13.64 LED1004.K 9.74,13.32 9.74,9.19 LED1005.K 9.74,8.88 9.74,4.75 LED1006.K 9.74,4.43 11.64,2.52 12.28,2.52 U$2.P$2
N$52
  Bottom 0.406: LED1051.K 14.19,40.31 14.19,36.18 LED991.K 14.19,35.86 14.19,31.73 LED992.K 14.19,31.42 14.19,27.29 LED993.K 14.19,26.97 14.19,22.84 LED994.K 14.19,22.53 14.19,18.08 LED995.K 14.19,17.76 14.19,13.64 LED996.K 14.19,13.32 14.19,9.19 LED997.K 14.19,8.88 14.19,4.75 LED998.K 14.19,4.43 16.09,2.52 16.73,2.52 U$2.P$3
N$53
  Bottom 0.406: LED1050.K 18.63,40.31 18.63,36.18 LED983.K 18.63,35.86 18.63,31.73 LED984.K 18.63,31.42 18.63,27.29 LED985.K 18.63,26.97 18.63,22.84 LED986.K 18.63,22.53 18.63,18.08 LED987.K 18.63,17.76 18.63,13.64 LED988.K 18.63,13.32 18.63,9.19 LED989.K 18.63,8.88 18.63,4.75 LED990.K 18.63,4.43 20.54,2.52 21.49,2.52 U$2.P$4
N$54
  Bottom 0.406: LED1049.K 23.07,40.31 23.07,36.18 LED975.K 23.07,35.86 23.07,31.73 LED976.K 23.07,31.42 23.07,27.29 LED977.K 23.07,26.97 23.07,22.84 LED978.K 23.07,22.53 23.07,18.08 LED979.K 23.07,17.76 23.07,13.64 LED980.K 23.07,13.32 23.07,9.19 LED981.K 23.07,8.88 23.07,4.75 LED982.K 23.07,4.43 24.98,2.52 25.93,2.52 U$2.P$5
N$55
  Bottom 0.406: LED1048.K 27.52,40.31 27.52,36.18 LED967.K 27.52,35.86 27.52,31.73 LED968.K 27.52,31.42 27.52,27.29 LED969.K 27.52,26.97 27.52,22.84 LED970.K 27.52,22.53 27.52,18.08 LED971.K 27.52,17.76 27.52,13.64 LED972.K 27.52,13.32 27.52,9.19 LED973.K 27.52,8.88 27.52,4.75 LED974.K 27.52,4.43 29.43,2.52 30.38,2.52 U$2.P$6
N$56
  Bottom 0.406: LED1047.K 31.96,40.31 31.96,36.18 LED959.K 31.96,35.86 31.96,31.73 LED960.K 31.96,31.42 31.96,27.29 LED961.K 31.96,26.97 31.96,22.84 LED962.K 31.96,22.53 31.96,18.08 LED963.K 31.96,17.76 31.96,13.64 LED964.K 31.96,13.32 31.96,9.19 LED965.K 31.96,8.88 31.96,4.75 LED966.K 31.96,4.43 33.87,2.52 34.82,2.52 U$2.P$7
N$57
  Bottom 0.406: LED1046.K 36.73,40.31 36.73,36.18 LED951.K 36.73,35.86 36.73,31.73 LED952.K 36.73,31.42 36.73,27.29 LED953.K 36.73,26.97 36.73,22.84 LED954.K 36.73,22.53 36.73,18.08 LED955.K 36.73,17.76 36.73,13.64 LED956.K 36.73,13.32 36.73,9.19 LED957.K 36.73,8.88 36.73,4.75 LED958.K 36.73,4.43 38.63,2.52 39.27,2.52 U$2.P$8
N$58
  Bottom 0.406: LED1045.K 41.17,40.31 41.17,36.18 LED943.K 41.17,35.86 41.17,31.73 LED944.K 41.17,31.42 41.17,27.29 LED945.K 41.17,26.97 41.17,22.84 LED946.K 41.17,22.53 41.17,18.08 LED947.K 41.17,17.76 41.17,13.64 LED948.K 41.17,13.32 41.17,9.19 LED949.K 41.17,8.88 41.17,4.75 LED950.K 41.17,4.43 43.08,2.52 43.71,2.52 U$2.P$9
N$59
  Bottom 0.406: LED1044.K 45.62,40.31 45.62,36.18 LED935.K 45.62,35.86 45.62,31.73 LED936.K 45.62,31.42 45.62,27.29 LED937.K 45.62,26.97 45.62,22.84 LED938.K 45.62,22.53 45.62,18.08 LED939.K 45.62,17.76 45.62,13.64 LED940.K 45.62,13.32 45.62,9.19 LED941.K 45.62,8.88 45.62,4.75 LED942.K 45.62,4.43 47.52,2.52 48.47,2.52 U$2.P$10
N$60
  Bottom 0.406: LED1043.K 50.06,40.31 50.06,36.18 LED927.K 50.06,35.86 50.06,31.73 LED928.K 50.06,31.42 50.06,27.29 LED929.K 50.06,26.97 50.06,22.84 LED930.K 50.06,22.53 50.06,18.08 LED931.K 50.06,17.76 50.06,13.64 LED932.K 50.06,13.32 50.06,9.19 LED933.K 50.06,8.88 50.06,4.75 LED934.K 50.06,4.43 51.97,2.52 52.92,2.52 U$2.P$11
N$61
  Bottom 0.406: LED1042.K 54.51,40.31 54.51,36.18 LED919.K 54.51,35.86 54.51,31.73 LED920.K 54.51,31.42 54.51,27.29 LED921.K 54.51,26.97 54.51,22.84 LED922.K 54.51,22.53 54.51,18.08 LED923.K 54.51,17.76 54.51,13.64 LED924.K 54.51,13.32 54.51,9.19 LED925.K 54.51,8.88 54.51,4.75 LED926.K 54.51,4.43 56.41,2.52 57.36,2.52 U$2.P$12
N$62
  Bottom 0.406: LED1041.K 58.95,40.31 58.95,36.18 LED911.K 58.95,35.86 58.95,31.73 LED912.K 58.95,31.42 58.95,27.29 LED913.K 58.95,26.97 58.95,22.84 LED914.K 58.95,22.53 58.95,18.08 LED915.K 58.95,17.76 58.95,13.64 LED916.K 58.95,13.32 58.95,9.19 LED917.K 58.95,8.88 58.95,4.75 LED918.K 58.95,4.43 60.86,2.52 61.81,2.52 U$2.P$13
N$63
  Bottom 0.406: LED1040.K 63.72,40.31 63.72,36.18 LED903.K 63.72,35.86 63.72,31.73 LED904.K 63.72,31.42 63.72,27.29 LED905.K 63.72,26.97 63.72,22.84 LED906.K 63.72,22.53 63.72,18.08 LED907.K 63.72,17.76 63.72,13.64 LED908.K 63.72,13.32 63.72,9.19 LED909.K 63.72,8.88 63.72,4.75 LED910.K 63.72,4.43 65.62,2.52 66.25,2.52 U$2.P$14
N$64
  Bottom 0.406: LED1039.K 68.16,40.31 68.16,36.18 LED895.K 68.16,35.86 68.16,31.73 LED896.K 68.16,31.42 68.16,27.29 LED897.K 68.16,26.97 68.16,22.84 LED898.K 68.16,22.53 68.16,18.08 LED899.K 68.16,17.76 68.16,13.64 LED900.K 68.16,13.32 68.16,9.19 LED901.K 68.16,8.88 68.16,4.75 LED902.K 68.16,4.43 70.06,2.52 70.7,2.52 U$2.P$15
N$65
  Bottom 0.406: LED1038.K 72.61,40.31 72.61,36.18 LED887.K 72.61,35.86 72.61,31.73 LED888.K 72.61,31.42 72.61,27.29 LED889.K 72.61,26.97 72.61,22.84 LED890.K 72.61,22.53 72.61,18.08 LED891.K 72.61,17.76 72.61,13.64 LED892.K 72.61,13.32 72.61,9.19 LED893.K 72.61,8.88 72.61,4.75 LED894.K 72.61,4.43 74.51,2.52 75.46,2.52 U$2.P$16
N$66
  Bottom 0.406: LED1037.K 77.05,40.31 77.05,36.18 LED879.K 77.05,35.86 77.05,31.73 LED880.K 77.05,31.42 77.05,27.29 LED881.K 77.05,26.97 77.05,22.84 LED882.K 77.05,22.53 77.05,18.08 LED883.K 77.05,17.76 77.05,13.64 LED884.K 77.05,13.32 77.05,9.19 LED885.K 77.05,8.88 77.05,4.75 LED886.K 77.05,4.43 78.95,2.52 79.91,2.52 U$2.P$17
N$67
  Bottom 0.406: LED1036.K 81.49,40.31 81.49,36.18 LED871.K 81.49,35.86 81.49,31.73 LED872.K 81.49,31.42 81.49,27.29 LED873.K 81.49,26.97 81.49,22.84 LED874.K 81.49,22.53 81.49,18.08 LED875.K 81.49,17.76 81.49,13.64 LED876.K 81.49,13.32 81.49,9.19 LED877.K 81.49,8.88 81.49,4.75 LED878.K 81.49,4.43 83.4,2.52 84.35,2.52 U$2.P$18
N$68
  Bottom 0.406: LED1035.K 85.94,40.31 85.94,36.18 LED863.K 85.94,35.86 85.94,31.73 LED864.K 85.94,31.42 85.94,27.29 LED865.K 85.94,26.97 85.94,22.84 LED866.K 85.94,22.53 85.94,18.08 LED867.K 85.94,17.76 85.94,13.64 LED868.K 85.94,13.32 85.94,9.19 LED869.K 85.94,8.88 85.94,4.75 LED870.K 86.26,4.43 88.16,2.52 88.8,2.52 U$2.P$19
N$69
  Bottom 0.406: LED1034.K 90.7,40.31 90.7,36.18 LED855.K 90.7,35.86 90.7,31.73 LED856.K 90.7,31.42 90.7,27.29 LED857.K 90.7,26.97 90.7,22.84 LED858.K 90.7,22.53 90.7,18.08 LED859.K 90.7,17.76 90.7,13.64 LED860.K 90.7,13.32 90.7,9.19 LED861.K 90.7,8.88 90.7,4.75 LED862.K 90.7,4.43 92.61,2.52 93.24,2.52 U$2.P$20
N$70
  Bottom 0.406: LED1033.K 95.15,40.31 95.15,36.18 LED847.K 95.15,35.86 95.15,31.73 LED848.K 95.15,31.42 95.15,27.29 LED849.K 95.15,26.97 95.15,22.84 LED850.K 95.15,22.53 95.15,18.08 LED851.K 95.15,17.76 95.15,13.64 LED852.K 95.15,13.32 95.15,9.19 LED853.K 95.15,8.88 95.15,4.75 LED854.K 95.15,4.43 97.05,2.52 97.69,2.52 U$2.P$21
N$71
  Bottom 0.406: LED1032.K 99.59,40.31 99.59,36.18 LED839.K 99.59,35.86 99.59,31.73 LED840.K 99.59,31.42 99.59,27.29 LED841.K 99.59,26.97 99.59,22.84 LED842.K 99.59,22.53 99.59,18.08 LED843.K 99.59,17.76 99.59,13.64 LED844.K 99.59,13.32 99.59,9.19 LED845.K 99.59,8.88 99.59,4.75 LED846.K 99.59,4.43 101.5,2.52 102.45,2.52 U$2.P$22
N$72
  Bottom 0.406: LED1031.K 104.04,40.31 104.04,36.18 LED831.K 104.04,35.86 104.04,31.73 LED832.K 104.04,31.42 104.04,27.29 LED833.K 104.04,26.97 104.04,22.84 LED834.K 104.04,22.53 104.04,18.08 LED835.K 104.04,17.76 104.04,13.64 LED836.K 104.04,13.32 104.04,9.19 LED837.K 104.04,8.88 104.04,4.75 LED838.K 104.04,4.43 105.94,2.52 106.89,2.52 U$2.P$23
N$73
  Bottom 0.406: LED1030.K 108.48,40.31 108.48,36.18 LED823.K 108.48,35.86 108.48,31.73 LED824.K 108.48,31.42 108.48,27.29 LED825.K 108.48,26.97 108.48,22.84 LED826.K 108.48,22.53 108.48,18.08 LED827.K 108.48,17.76 108.48,13.64 LED828.K 108.48,13.32 108.48,9.19 LED829.K 108.48,8.88 108.48,4.75 LED830.K 108.48,4.43 110.39,2.52 111.34,2.52 U$2.P$24
N$74
  Bottom 0.406: LED1029.K 113.24,40.31 113.24,36.18 LED815.K 113.24,35.86 113.24,31.73 LED816.K 113.24,31.42 113.24,27.29 LED817.K 113.24,26.97 113.24,22.84 LED818.K 113.24,22.53 113.24,18.08 LED819.K 113.24,17.76 113.24,13.64 LED820.K 113.24,13.32 113.24,9.19 LED821.K 113.24,8.88 113.24,4.75 LED822.K 113.24,4.43 115.15,2.52 115.78,2.52 U$2.P$25
N$75
  Bottom 0.406: LED1028.K 117.69,40.31 117.69,36.18 LED807.K 117.69,35.86 117.69,31.73 LED808.K 117.69,31.42 117.69,27.29 LED809.K 117.69,26.97 117.69,22.84 LED810.K 117.69,22.53 117.69,18.08 LED811.K 117.69,17.76 117.69,13.64 LED812.K 117.69,13.32 117.69,9.19 LED813.K 117.69,8.88 117.69,4.75 LED814.K 117.69,4.43 119.59,2.52 120.23,2.52 U$2.P$26
N$76
  Bottom 0.406: LED1027.K 122.13,40.31 122.13,36.18 LED799.K 122.13,35.86 122.13,31.73 LED800.K 122.13,31.42 122.13,27.29 LED801.K 122.13,26.97 122.13,22.84 LED802.K 122.13,22.53 122.13,18.08 LED803.K 122.13,17.76 122.13,13.64 LED804.K 122.13,13.32 122.13,9.19 LED805.K 122.13,8.88 122.13,4.75 LED806.K 122.13,4.43 124.04,2.52 124.99,2.52 U$2.P$27
N$77
  Bottom 0.406: LED1026.K 126.58,40.31 126.58,36.18 LED791.K 126.58,35.86 126.58,31.73 LED792.K 126.58,31.42 126.58,27.29 LED793.K 126.58,26.97 126.58,22.84 LED794.K 126.58,22.53 126.58,18.08 LED795.K 126.58,17.76 126.58,13.64 LED796.K 126.58,13.32 126.58,9.19 LED797.K 126.58,8.88 126.58,4.75 LED798.K 126.58,4.43 128.49,2.52 129.44,2.52 U$2.P$28
N$78
  Bottom 0.406: LED1025.K 131.03,40.31 131.03,36.18 LED783.K 131.03,35.86 131.03,31.73 LED784.K 131.03,31.42 131.03,27.29 LED785.K 131.03,26.97 131.03,22.84 LED786.K 131.03,22.53 131.03,18.08 LED787.K 131.03,17.76 131.03,13.64 LED788.K 131.03,13.32 131.03,9.19 LED789.K 131.03,8.88 131.03,4.75 LED790.K 131.03,4.43 132.93,2.52 133.88,2.52 U$2.P$29
N$79
  Bottom 0.406: LED1023.K 140.23,40.31 140.23,36.18 LED767.K 140.23,35.86 140.23,31.73 LED768.K 140.23,31.42 140.23,27.29 LED769.K 140.23,26.97 140.23,22.84 LED770.K 140.23,22.53 140.23,18.08 LED771.K 140.23,17.76 140.23,13.64 LED772.K 140.23,13.32 140.23,9.19 LED773.K 140.23,8.88 140.23,4.75 LED774.K 140.23,4.43 142.14,2.52 142.77,2.52 U$2.P$31
N$80
  Bottom 0.406: LED1019.K 158.01,40.31 158.01,36.18 LED735.K 158.01,35.86 158.01,31.73 LED736.K 158.01,31.42 158.01,27.29 LED737.K 158.01,26.97 158.01,22.84 LED738.K 158.01,22.53 158.01,18.08 LED739.K 158.01,17.76 158.01,13.64 LED740.K 158.01,13.32 158.01,9.19 LED741.K 158.01,8.88 158.01,4.75 LED742.K 158.01,4.43 159.92,2.52 160.87,2.52 U$2.P$35
N$81
  Bottom 0.406: LED1018.K 162.46,40.31 162.46,36.18 LED727.K 162.46,35.86 162.46,31.73 LED728.K 162.46,31.42 162.46,27.29 LED729.K 162.46,26.97 162.46,22.84 LED730.K 162.46,22.53 162.46,18.08 LED731.K 162.46,17.76 162.46,13.64 LED732.K 162.46,13.32 162.46,9.19 LED733.K 162.46,8.88 162.46,4.75 LED734.K 162.46,4.43 164.36,2.52 165.31,2.52 U$2.P$36
N$82
  Bottom 0.406: LED1017.K 167.22,40.31 167.22,36.18 LED719.K 167.22,35.86 167.22,31.73 LED720.K 167.22,31.42 167.22,27.29 LED721.K 167.22,26.97 167.22,22.84 LED722.K 167.22,22.53 167.22,18.08 LED723.K 167.22,17.76 167.22,13.64 LED724.K 167.22,13.32 167.22,9.19 LED725.K 167.22,8.88 167.22,4.75 LED726.K 167.22,4.43 169.12,2.52 169.76,2.52 U$2.P$37
N$83
  Bottom 0.406: LED1016.K 171.67,40.31 171.67,36.18 LED711.K 171.67,35.86 171.67,31.73 LED712.K 171.67,31.42 171.67,27.29 LED713.K 171.67,26.97 171.67,22.84 LED714.K 171.67,22.53 171.67,18.08 LED715.K 171.67,17.76 171.67,13.64 LED716.K 171.67,13.32 171.67,9.19 LED717.K 171.67,8.88 171.67,4.75 LED718.K 171.67,4.43 173.57,2.52 174.21,2.52 U$2.P$38
N$84
  Top 0.406: LED624.K 178.02,82.85 178.02,78.72 LED623.K 178.02,78.41 178.02,73.96 LED622.K 178.02,73.64 178.02,69.52 LED621.K 178.02,69.2 178.02,65.07 LED620.K 178.02,64.75 178.02,60.63 LED619.K 178.02,60.31 178.02,56.18 LED618.K 178.02,55.86 178.02,51.42 LED617.K 178.02,51.1 178.02,46.97 LED39.K
  Bottom 0.406: U$1.P$1 174.84,85.07 176.75,83.17 177.7,83.17 LED624.K
N$85
  Bottom 0.406: U$1.P$2 170.4,85.07 172.3,83.17 172.94,83.17 LED616.K 173.25,82.85 173.25,78.72 LED615.K 173.25,78.41 173.25,73.96 LED614.K 173.25,73.64 173.25,69.52 LED613.K 173.25,69.2 173.25,65.07 LED612.K 173.25,64.75 173.25,60.63 LED611.K 173.25,60.31 173.25,56.18 LED610.K 173.25,55.86 173.25,51.42 LED609.K 173.25,51.1 173.25,46.97 LED38.K
N$86
  Bottom 0.406: U$1.P$3 165.95,85.07 167.86,83.17 168.49,83.17 LED608.K 168.81,82.85 168.81,78.72 LED607.K 168.81,78.41 168.81,73.96 LED606.K 168.81,73.64 168.81,69.52 LED605.K 168.81,69.2 168.81,65.07 LED604.K 168.81,64.75 168.81,60.63 LED603.K 168.81,60.31 168.81,56.18 LED602.K 168.81,55.86 168.81,51.42 LED601.K 168.81,51.1 168.81,46.97 LED37.K
N$87
  Bottom 0.406: U$1.P$4 161.19,85.07 163.09,83.17 164.05,83.17 LED600.K 164.36,82.85 164.36,78.72 LED599.K 164.36,78.41 164.36,73.96 LED598.K 164.36,73.64 164.36,69.52 LED597.K 164.36,69.2 164.36,65.07 LED596.K 164.36,64.75 164.36,60.63 LED595.K 164.36,60.31 164.36,56.18 LED594.K 164.36,55.86 164.36,51.42 LED593.K 164.36,51.1 164.36,46.97 LED36.K
N$88
  Bottom 0.406: U$1.P$5 156.74,85.07 158.65,83.17 159.6,83.17 LED592.K 159.92,82.85 159.92,78.72 LED591.K 159.92,78.41 159.92,73.96 LED590.K 159.92,73.64 159.92,69.52 LED589.K 159.92,69.2 159.92,65.07 LED588.K 159.92,64.75 159.92,60.63 LED587.K 159.92,60.31 159.92,56.18 LED586.K 159.92,55.86 159.92,51.42 LED585.K 159.92,51.1 159.92,46.97 LED35.K
N$89
  Bottom 0.406: U$1.P$6 152.3,85.07 154.2,83.17 155.16,83.17 LED584.K 155.47,82.85 155.47,78.72 LED583.K 155.47,78.41 155.47,73.96 LED582.K 155.47,73.64 155.47,69.52 LED581.K 155.47,69.2 155.47,65.07 LED580.K 155.47,64.75 155.47,60.63 LED579.K 155.47,60.31 155.47,56.18 LED578.K 155.47,55.86 155.47,51.42 LED577.K 155.47,51.1 155.47,46.97 LED34.K
N$90
  Bottom 0.406: U$1.P$7 147.85,85.07 149.76,83.17 150.71,83.17 LED576.K 151.03,82.85 151.03,78.72 LED575.K 151.03,78.41 151.03,73.96 LED574.K 151.03,73.64 151.03,69.52 LED573.K 151.03,69.2 151.03,65.07 LED572.K 151.03,64.75 151.03,60.63 LED571.K 151.03,60.31 151.03,56.18 LED570.K 151.03,55.86 151.03,51.42 LED569.K 151.03,51.1 151.03,46.97 LED33.K
N$91
  Bottom 0.406: U$1.P$8 143.41,85.07 145.31,83.17 145.95,83.17 LED568.K 146.27,82.85 146.27,78.72 LED567.K 146.27,78.41 146.27,73.96 LED566.K 146.27,73.64 146.27,69.52 LED565.K 146.27,69.2 146.27,65.07 LED564.K 146.27,64.75 146.27,60.63 LED563.K 146.27,60.31 146.27,56.18 LED562.K 146.27,55.86 146.27,51.42 LED561.K 146.27,51.1 146.27,46.97 LED32.K
N$92
  Bottom 0.406: U$1.P$9 138.96,85.07 140.87,83.17 141.5,83.17 LED560.K 141.82,82.85 141.82,78.72 LED559.K 141.82,78.41 141.82,73.96 LED558.K 141.82,73.64 141.82,69.52 LED557.K 141.82,69.2 141.82,65.07 LED556.K 141.82,64.75 141.82,60.63 LED555.K 141.82,60.31 141.82,56.18 LED554.K 141.82,55.86 141.82,51.42 LED553.K 141.82,51.1 141.82,46.97 LED31.K
N$93
  Bottom 0.406: U$1.P$10 134.2,85.07 136.11,83.17 137.06,83.17 LED552.K 137.38,82.85 137.38,78.72 LED551.K 137.38,78.41 137.38,73.96 LED550.K 137.38,73.64 137.38,69.52 LED549.K 137.38,69.2 137.38,65.07 LED548.K 137.38,64.75 137.38,60.63 LED547.K 137.38,60.31 137.38,56.18 LED546.K 137.38,55.86 137.38,51.42 LED545.K 137.38,51.1 137.38,46.97 LED30.K
N$94
  Bottom 0.406: U$1.P$11 129.76,85.07 131.66,83.17 132.61,83.17 LED544.K 132.93,82.85 132.93,78.72 LED543.K 132.93,78.41 132.93,73.96 LED542.K 132.93,73.64 132.93,69.52 LED541.K 132.93,69.2 132.93,65.07 LED540.K 132.93,64.75 132.93,60.63 LED539.K 132.93,60.31 132.93,56.18 LED538.K 132.93,55.86 132.93,51.42 LED537.K 132.93,51.1 132.93,46.97 LED29.K
N$95
  Bottom 0.406: U$1.P$12 125.31,85.07 127.21,83.17 128.17,83.17 LED536.K 128.49,82.85 128.49,78.72 LED535.K 128.49,78.41 128.49,73.96 LED534.K 128.49,73.64 128.49,69.52 LED533.K 128.49,69.2 128.49,65.07 LED532.K 128.49,64.75 128.49,60.63 LED531.K 128.49,60.31 128.49,56.18 LED530.K 128.49,55.86 128.49,51.42 LED529.K 128.49,51.1 128.49,46.97 LED28.K
N$96
  Bottom 0.406: U$1.P$13 120.86,85.07 122.77,83.17 123.72,83.17 LED528.K 123.72,82.85 123.72,78.72 LED527.K 123.72,73.96 LED526.K 123.72,73.64 123.72,69.52 LED525.K 123.72,69.2 123.72,65.07 LED524.K 123.72,64.75 123.72,60.63 LED523.K 123.72,60.31 123.72,56.18 LED522.K 123.72,55.86 123.72,51.42 LED521.K 123.72,51.1 123.72,46.97 LED27.K
N$97
  Bottom 0.406: U$1.P$14 116.42,85.07 118.33,83.17 118.96,83.17 LED520.K 119.28,82.85 119.28,78.72 LED519.K 119.28,78.41 119.28,73.96 LED518.K 119.28,73.64 119.28,69.52 LED517.K 119.28,69.2 119.28,65.07 LED516.K 119.28,64.75 119.28,60.63 LED515.K 119.28,60.31 119.28,56.18 LED514.K 119.28,55.86 119.28,51.42 LED513.K 119.28,51.1 119.28,46.97 LED26.K
N$98
  Bottom 0.406: U$1.P$15 111.97,85.07 113.88,83.17 114.52,83.17 LED512.K 114.83,82.85 114.83,78.72 LED511.K 114.83,78.41 114.83,73.96 LED510.K 114.83,73.64 114.83,69.52 LED509.K 114.83,69.2 114.83,65.07 LED508.K 114.83,64.75 114.83,60.63 LED507.K 114.83,60.31 114.83,56.18 LED506.K 114.83,55.86 114.83,51.42 LED505.K 114.83,51.1 114.83,46.97 LED25.K
N$99
  Bottom 0.406: U$1.P$16 107.21,85.07 109.12,83.17 110.07,83.17 LED504.K 110.39,82.85 110.39,78.72 LED503.K 110.39,78.41 110.39,73.96 LED502.K 110.39,73.64 110.39,69.52 LED501.K 110.39,69.2 110.39,65.07 LED500.K 110.39,64.75 110.39,60.63 LED499.K 110.39,60.31 110.39,56.18 LED498.K 110.39,55.86 110.39,51.42 LED497.K 110.39,51.1 110.39,46.97 LED24.K
N$100
  Bottom 0.406: U$1.P$17 102.77,85.07 104.67,83.17 105.62,83.17 LED496.K 105.94,82.85 105.94,78.72 LED495.K 105.94,78.41 105.94,73.96 LED494.K 105.94,73.64 105.94,69.52 LED493.K 105.94,69.2 105.94,65.07 LED492.K 105.94,64.75 105.94,60.63 LED491.K 105.94,60.31 105.94,56.18 LED490.K 105.94,55.86 105.94,51.42 LED489.K 105.94,51.1 105.94,46.97 LED23.K
N$101
  Bottom 0.406: U$1.P$18 98.32,85.07 100.23,83.17 101.18,83.17 LED488.K 101.5,82.85 101.5,78.72 LED487.K 101.5,78.41 101.5,73.96 LED486.K 101.5,73.64 101.5,69.52 LED485.K 101.5,69.2 101.5,65.07 LED484.K 101.5,64.75 101.5,60.63 LED483.K 101.5,60.31 101.5,56.18 LED482.K 101.5,55.86 101.5,51.42 LED481.K 101.5,51.1 101.5,46.97 LED22.K
N$102
  Bottom 0.406: U$1.P$19 93.88,85.07 95.78,83.17 96.42,83.17 LED480.K 96.73,82.85 96.73,78.72 LED479.K 96.73,73.96 LED478.K 96.73,73.64 96.73,69.52 LED477.K 96.73,69.2 96.73,65.07 LED476.K 96.73,64.75 96.73,60.63 LED475.K 96.73,60.31 96.73,56.18 LED474.K 96.73,55.86 96.73,51.42 LED473.K 96.73,51.1 96.73,46.97 LED21.K
N$103